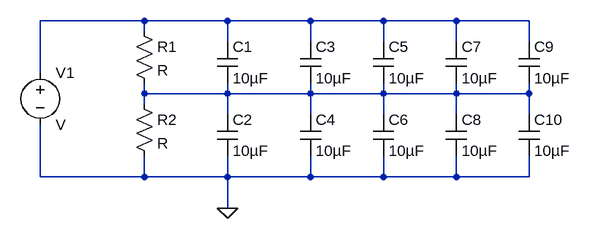
[diagram p0: schematic MonteCarlo-DC1.asc]
MonteCarlo-DC1.asc, the LTspice schematic file:
Version 4
SHEET 1 880 680
WIRE -48 80 -208 80
WIRE 80 80 -48 80
WIRE 208 80 80 80
WIRE 320 80 208 80
WIRE 432 80 320 80
WIRE 544 80 432 80
WIRE -48 96 -48 80
WIRE 80 112 80 80
WIRE 208 112 208 80
WIRE 320 112 320 80
WIRE 432 112 432 80
WIRE 544 112 544 80
WIRE -208 160 -208 80
WIRE -48 192 -48 176
WIRE 80 192 80 176
WIRE 80 192 -48 192
WIRE 208 192 208 176
WIRE 208 192 80 192
WIRE 320 192 320 176
WIRE 320 192 208 192
WIRE 432 192 432 176
WIRE 432 192 320 192
WIRE 544 192 544 176
WIRE 544 192 432 192
WIRE -48 208 -48 192
WIRE 80 224 80 192
WIRE 208 224 208 192
WIRE 320 224 320 192
WIRE 432 224 432 192
WIRE 544 224 544 192
WIRE -208 320 -208 240
WIRE -48 320 -48 288
WIRE -48 320 -208 320
WIRE 80 320 80 288
WIRE 80 320 -48 320
WIRE 208 320 208 288
WIRE 208 320 80 320
WIRE 320 320 320 288
WIRE 320 320 208 320
WIRE 432 320 432 288
WIRE 432 320 320 320
WIRE 544 320 544 288
WIRE 544 320 432 320
WIRE 80 368 80 320
FLAG 80 368 0
SYMBOL cap 64 112 R0
SYMATTR InstName C1
SYMATTR Value 10µF
SYMATTR SpiceLine V=50v Rser=30m Lser=0.8n Rpar=500M Cpar=0
SYMBOL cap 64 224 R0
SYMATTR InstName C2
SYMATTR Value 10µF
SYMATTR SpiceLine V=50v Rser=30m Lser=0.8n Rpar=500M Cpar=0
SYMBOL cap 192 112 R0
SYMATTR InstName C3
SYMATTR Value 10µF
SYMATTR SpiceLine V=50v Rser=30m Lser=0.8n Rpar=500M Cpar=0
SYMBOL cap 192 224 R0
SYMATTR InstName C4
SYMATTR Value 10µF
SYMATTR SpiceLine V=50v Rser=30m Lser=0.8n Rpar=500M Cpar=0
SYMBOL cap 304 112 R0
SYMATTR InstName C5
SYMATTR Value 10µF
SYMATTR SpiceLine V=50v Rser=30m Lser=0.8n Rpar=500M Cpar=0
SYMBOL cap 304 224 R0
SYMATTR InstName C6
SYMATTR Value 10µF
SYMATTR SpiceLine V=50v Rser=30m Lser=0.8n Rpar=500M Cpar=0
SYMBOL cap 416 112 R0
SYMATTR InstName C7
SYMATTR Value 10µF
SYMATTR SpiceLine V=50v Rser=30m Lser=0.8n Rpar=500M Cpar=0
SYMBOL cap 416 224 R0
SYMATTR InstName C8
SYMATTR Value 10µF
SYMATTR SpiceLine V=50v Rser=30m Lser=0.8n Rpar=500M Cpar=0
SYMBOL cap 528 112 R0
SYMATTR InstName C9
SYMATTR Value 10µF
SYMATTR SpiceLine V=50v Rser=30m Lser=0.8n Rpar=500M Cpar=0
SYMBOL cap 528 224 R0
SYMATTR InstName C10
SYMATTR Value 10µF
SYMATTR SpiceLine V=50v Rser=30m Lser=0.8n Rpar=500M Cpar=0
SYMBOL res -64 80 R0
SYMATTR InstName R1
SYMBOL res -64 192 R0
SYMATTR InstName R2
SYMBOL voltage -208 144 R0
SYMATTR InstName V1

The netlist it stands for:
* MonteCarlo-DC1.asc
C1 N001 N002 10µF V=50v Rser=30m Lser=0.8n Rpar=500M Cpar=0
C2 N002 0 10µF V=50v Rser=30m Lser=0.8n Rpar=500M Cpar=0
C3 N001 N002 10µF V=50v Rser=30m Lser=0.8n Rpar=500M Cpar=0
C4 N002 0 10µF V=50v Rser=30m Lser=0.8n Rpar=500M Cpar=0
C5 N001 N002 10µF V=50v Rser=30m Lser=0.8n Rpar=500M Cpar=0
C6 N002 0 10µF V=50v Rser=30m Lser=0.8n Rpar=500M Cpar=0
C7 N001 N002 10µF V=50v Rser=30m Lser=0.8n Rpar=500M Cpar=0
C8 N002 0 10µF V=50v Rser=30m Lser=0.8n Rpar=500M Cpar=0
C9 N001 N002 10µF V=50v Rser=30m Lser=0.8n Rpar=500M Cpar=0
C10 N002 0 10µF V=50v Rser=30m Lser=0.8n Rpar=500M Cpar=0
R1 N001 N002 R
R2 N002 0 R
V1 N001 0 V
.backanno
.end